# Altium schematic sheet Ublox_breakout_schem.SchDoc
size E
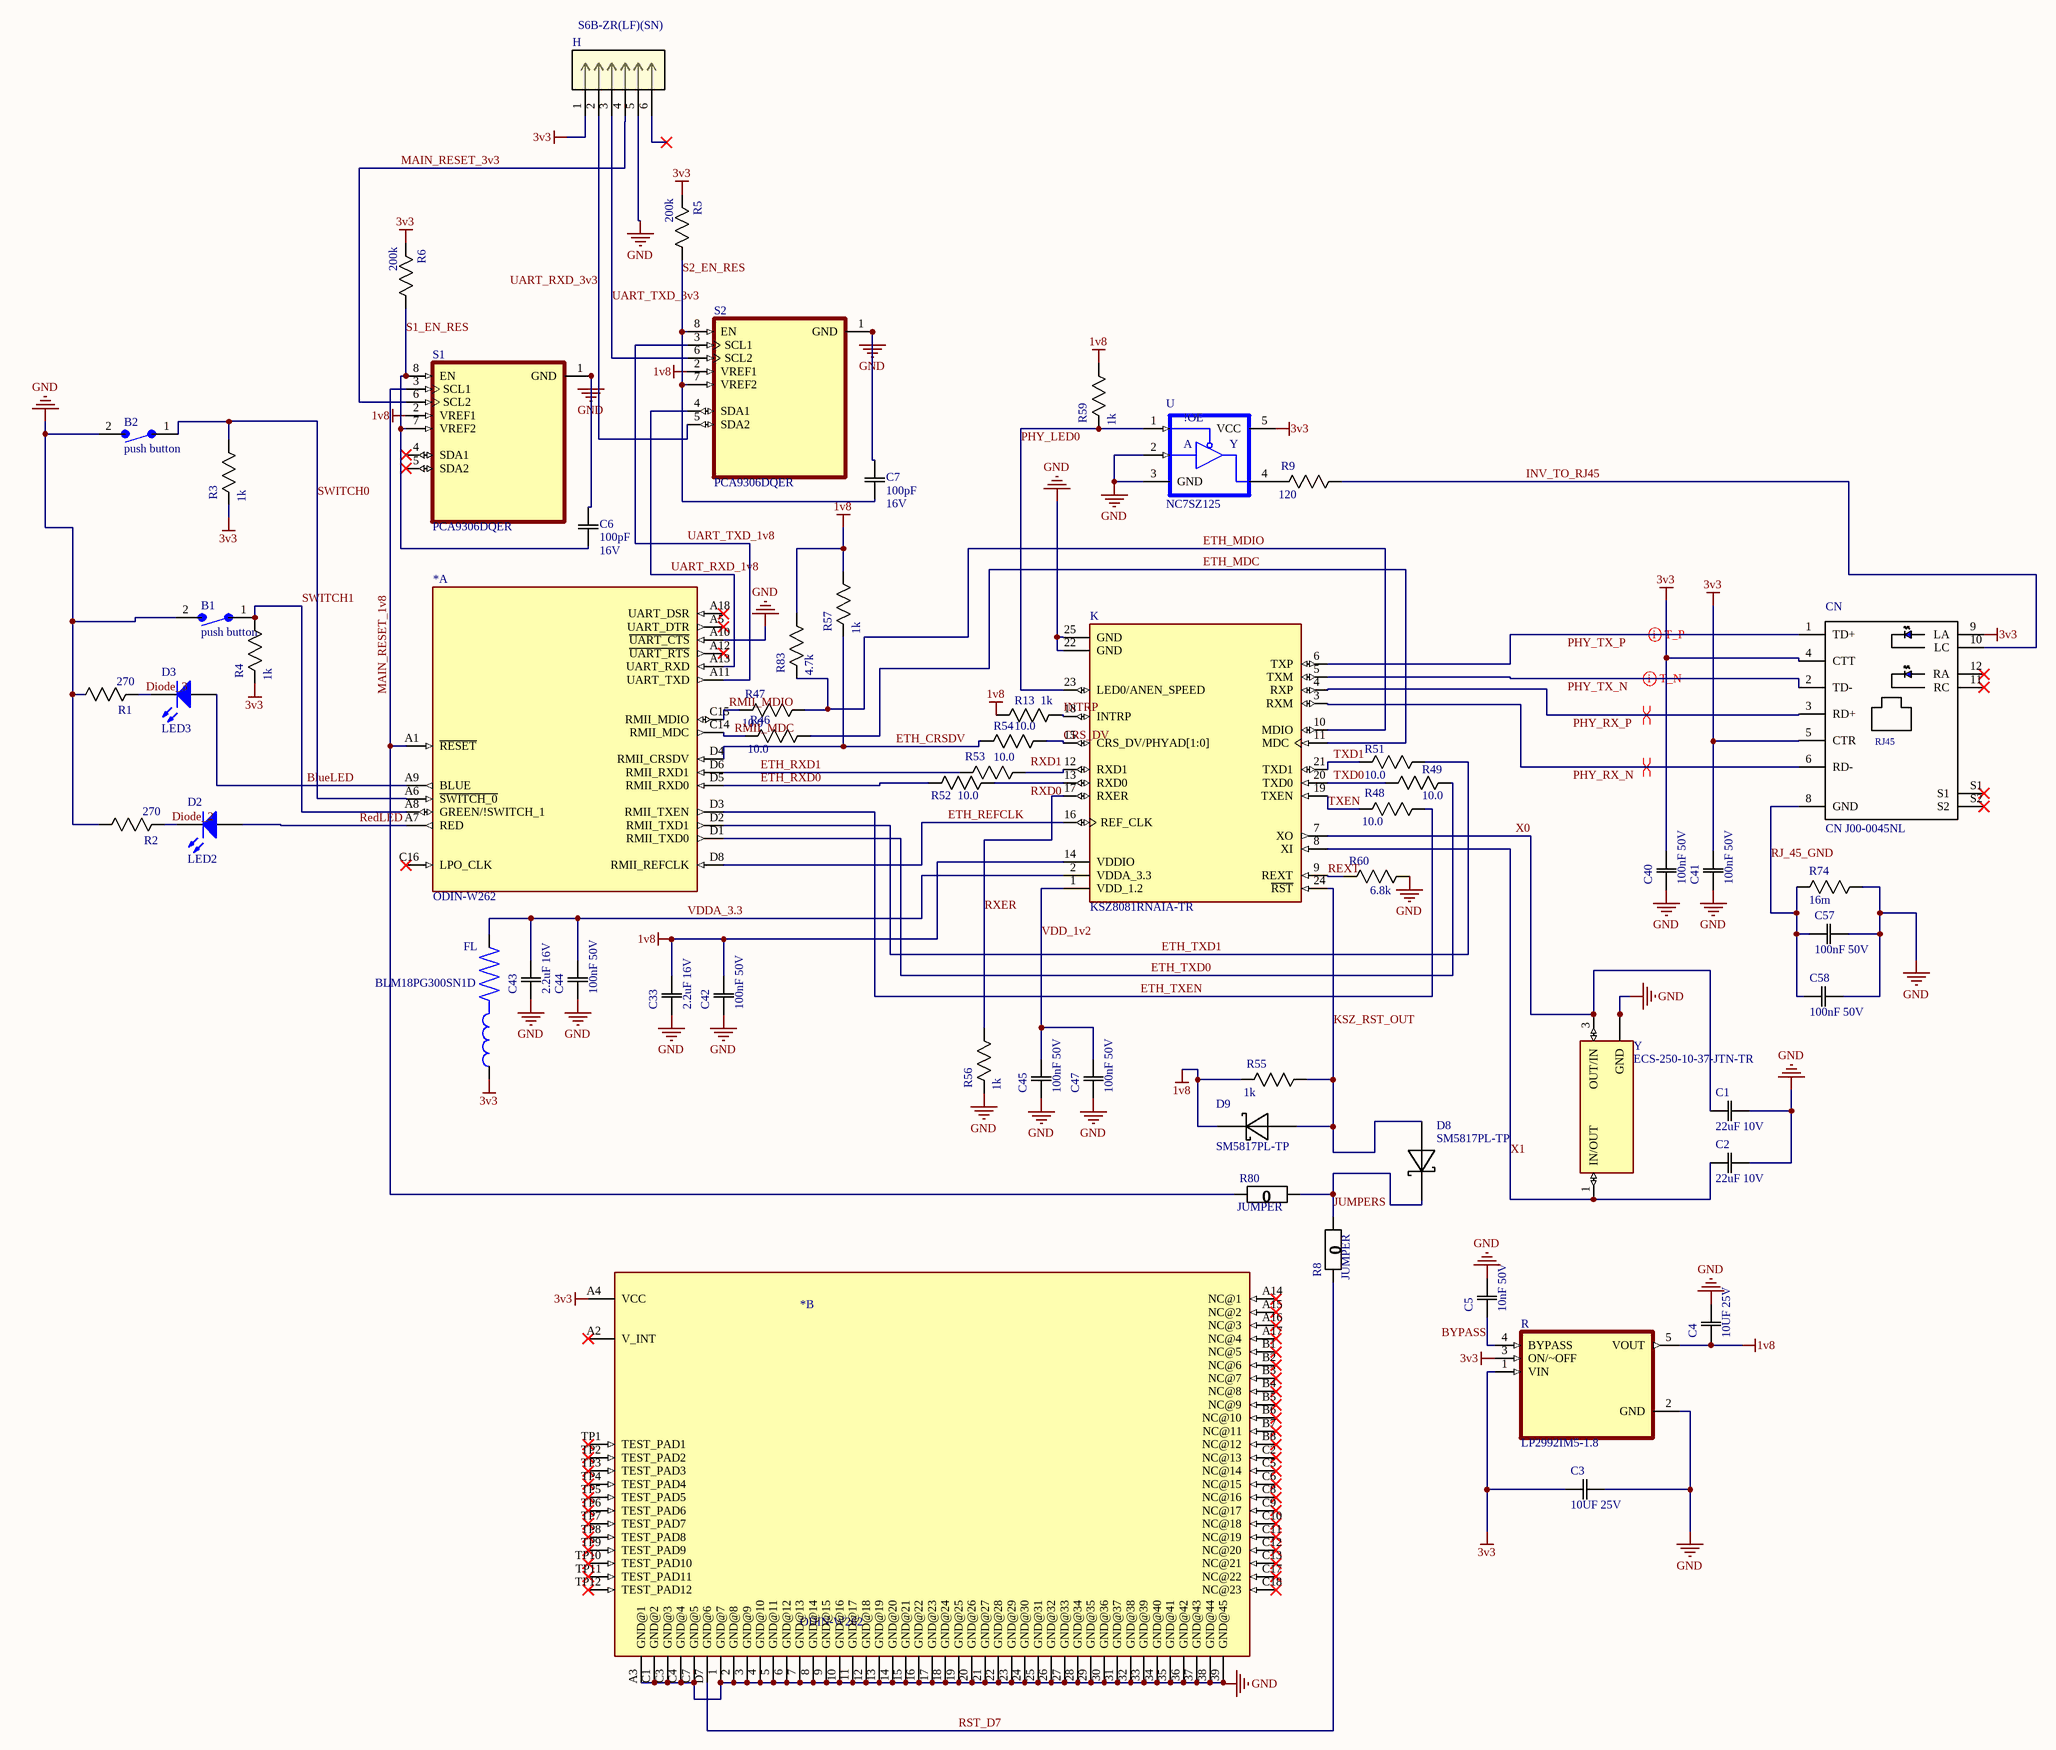
[diagram p0: Ublox_breakout_schem.SchDoc]

## Parts
(Parts that share a designator on the sheet are numbered #1, #2 ... from top to bottom, then left to right.)
*#1  ODIN-W262  [ODIN-W262]  (part A of 2)
*#2  ODIN-W262  [ODIN-W262]  (part B of 2)
B1  push button  [TECO-FSMSM]
B2  push button  [TECO-FSMSM]
C1  22uF 10V  [0805]
C2  22uF 10V  [0805]
C3  10UF 25V  [1206]
C4  10UF 25V  [1206]
C5  10nF 50V  [0805]
C6  Rating: 16V  [0603]  (hidden comment: 100pF)
C7  Rating: 16V  [0603]  (hidden comment: 100pF)
C33  2.2uF 16V  [0805]
C40  100nF 50V  [0805]
C41  100nF 50V  [0805]
C42  100nF 50V  [0805]
C43  2.2uF 16V  [0805]
C44  100nF 50V  [0805]
C45  100nF 50V  [0805]
C47  100nF 50V  [0805]
C57  100nF 50V  [0805]
C58  100nF 50V  [0805]
CN  CN J00-0045NL  [RJ45 J00-0045NL]
D2  LED2  [3.2X1.6X1.1]
D3  LED3  [3.5X2.8X1.9]
D8  SM5817PL-TP  [SOD-123]
D9  SM5817PL-TP  [SOD-123]
FL  BLM18PG300SN1D  [BEADC1608X95N]
H  S6B-ZR(LF)(SN)  [S6B-ZR_JST]
K  KSZ8081RNAIA-TR  [QFN50P400X400X90-25N]
R  LP2992IM5-1.8  [SOT95P280X145-5N]
R1  270  [0805]
R2  270  [0805]
R3  1k  [0805]
R4  1k  [0805]
R5  200k  [0805]
R6  200k  [0805]
R8  JUMPER  [0805]
R9  120  [0805]
R13  1k  [0805]
R46  10.0  [0805]
R47  10.0  [0805]
R48  10.0  [0805]
R49  10.0  [0805]
R51  10.0  [0805]
R52  10.0  [0805]
R53  10.0  [0805]
R54  10.0  [0805]
R55  1k  [0805]
R56  1k  [0805]
R57  1k  [0805]
R59  1k  [0805]
R60  6.8k  [0805]
R74  16m  [0805]
R80  JUMPER  [0805]
R83  4.7k  [0805]
S1  PCA9306DQER  [SON35P140X100X40-8N]
S2  PCA9306DQER  [SON35P140X100X40-8N]
U  NC7SZ125  [SC70-5]
Y  ECS-250-10-37-JTN-TR  [XTAL_ECS-250-10-37-JTN-TR]

## Nets
1v8: C4.1(C1) C33.2(C2) C42.2(C2) D9.C(K) K.14(VDDIO) R.5(VOUT) R13.2(R2) R55.2(R2) R57.1(R1) R59.1(R1) R83.1(R1) S1.2(VREF1) S2.2(VREF1)
3v3: *#2.A4(VCC) C3.1(C1) C40.2(C2) C41.2(C2) CN.4(CTT) CN.5(CTR) CN.9(LA) FL.1 H.1 R.1(VIN) R.3(ON/~OFF) R3.2(R2) R4.2(R2) R5.2(R2) R6.2(R2) U.5(VCC)
GND: *#1.A10(~{UART_CTS}) *#2.1(GND@7) *#2.2(GND@8) *#2.3(GND@9) *#2.4(GND@10) *#2.5(GND@11) *#2.6(GND@12) *#2.7(GND@13) *#2.8(GND@14) *#2.9(GND@15) *#2.10(GND@16) *#2.11(GND@17) *#2.12(GND@18) *#2.13(GND@19) *#2.14(GND@20) *#2.15(GND@21) *#2.16(GND@22) *#2.17(GND@23) *#2.18(GND@24) *#2.19(GND@25) *#2.20(GND@26) *#2.21(GND@27) *#2.22(GND@28) *#2.23(GND@29) *#2.24(GND@30) *#2.25(GND@31) *#2.26(GND@32) *#2.27(GND@33) *#2.28(GND@34) *#2.29(GND@35) *#2.30(GND@36) *#2.31(GND@37) *#2.32(GND@38) *#2.33(GND@39) *#2.34(GND@40) *#2.35(GND@41) *#2.36(GND@42) *#2.37(GND@43) *#2.38(GND@44) *#2.39(GND@45) *#2.A3(GND@1) *#2.C1(GND@2) *#2.C3(GND@3) *#2.C4(GND@4) *#2.C7(GND@5) B1.2 B2.2 C1.2(C2) C2.2(C2) C3.2(C2) C4.2(C2) C5.2(C2) C6.2(C2) C7.2(C2) C33.1(C1) C40.1(C1) C41.1(C1) C42.1(C1) C43.1(C1) C44.1(C1) C45.1(C1) C47.1(C1) C57.2(C2) C58.2(C2) H.5 K.22(GND) K.25(GND) R.2(GND) R1.1(R1) R2.1(R1) R56.2(R2) R60.1(R1) R74.1(R1) S1.1(GND) S2.1(GND) U.2(A) U.3(GND) Y.2(GND) Y.4(GND)
BlueLED: *#1.A9(BLUE) D3.1(A)
BYPASS: C5.1(C1) R.4(BYPASS)
CRS_DV: K.15(CRS_DV/PHYAD[1:0]) R54.1(R1)
Diode_2: D2.2(K) R2.2(R2)
Diode_3: D3.2(K) R1.2(R2)
ETH_CRSDV: *#1.D4(RMII_CRSDV) R54.2(R2) R57.2(R2)
ETH_MDC: K.11(MDC) R46.1(R1)
ETH_MDIO: K.10(MDIO) R47.1(R1) R83.2(R2)
ETH_REFCLK: *#1.D8(RMII_REFCLK) K.16(REF_CLK)
ETH_RXD0: *#1.D5(RMII_RXD0) R52.2(R2)
ETH_RXD1: *#1.D6(RMII_RXD1) R53.2(R2)
ETH_TXD0: *#1.D1(RMII_TXD0) R49.1(R1)
ETH_TXD1: *#1.D2(RMII_TXD1) R51.1(R1)
ETH_TXEN: *#1.D3(RMII_TXEN) R48.1(R1)
INTRP: K.18(INTRP) R13.1(R1)
INV_TO_RJ45: CN.10(LC) R9.1(R1)
JUMPERS: D8.C(K) R8.1(R1) R80.1(R1)
KSZ_RST_OUT: D8.A D9.A K.24(~{RST}) R55.1(R1)
MAIN_RESET_1v8: *#1.A1(~{RESET}) R80.2(R2) S1.3(SCL1)
MAIN_RESET_3v3: H.4 S1.6(SCL2)
PHY_LED0: K.23(LED0/ANEN_SPEED) R59.2(R2) U.1(OE#)
PHY_RX_N: CN.6(RD-) K.3(RXM)
PHY_RX_P: CN.3(RD+) K.4(RXP)
PHY_TX_N: CN.2(TD-) K.5(TXM)
PHY_TX_P: CN.1(TD+) K.6(TXP)
RedLED: *#1.A7(RED) D2.1(A)
REXT: K.9(REXT) R60.2(R2)
RJ_45_GND: C57.1(C1) C58.1(C1) CN.8(GND) R74.2(R2)
RMII_MDC: *#1.C14(RMII_MDC) R46.2(R2)
RMII_MDIO: *#1.C15(RMII_MDIO) R47.2(R2)
RST_D7: *#2.D7(GND@6) R8.2(R2)
RXD0: K.13(RXD0) R52.1(R1)
RXD1: K.12(RXD1) R53.1(R1)
RXER: K.17(RXER) R56.1(R1)
S1_EN_RES: C6.1(C1) R6.1(R1) S1.7(VREF2) S1.8(EN)
S2_EN_RES: C7.1(C1) R5.1(R1) S2.7(VREF2) S2.8(EN)
SWITCH0: *#1.A6(~{SWITCH_0}) B2.1 R3.1(R1)
SWITCH1: *#1.A8(GREEN/!SWITCH_1) B1.1 R4.1(R1)
TXD0: K.20(TXD0) R49.2(R2)
TXD1: K.21(TXD1) R51.2(R2)
TXEN: K.19(TXEN) R48.2(R2)
UART_RXD_1v8: *#1.A13(UART_RXD) S2.4(SDA1)
UART_RXD_3v3: H.2 S2.5(SDA2)
UART_TXD_1v8: *#1.A11(UART_TXD) S2.3(SCL1)
UART_TXD_3v3: H.3 S2.6(SCL2)
VDD_1v2: C45.2(C2) C47.2(C2) K.1(VDD_1.2)
VDDA_3.3: C43.2(C2) C44.2(C2) FL.2 K.2(VDDA_3.3)
X0: C1.1(C1) K.7(XO) Y.3(OUT/IN)
X1: C2.1(C1) K.8(XI) Y.1(IN/OUT)
NetR9_2: R9.2(R2) U.4(Y)

Not connected (* = marked no-connect by the designer): *#1 A5(UART_DTR)* A12(~{UART_RTS})* A18(UART_DSR)* C16(LPO_CLK)*; *#2 A2(V_INT)* A14(NC@1)* A15(NC@2)* A16(NC@3)* A17(NC@4)* B1(NC@5)* B2(NC@6)* B3(NC@7)* B4(NC@8)* B5(NC@9)* B6(NC@10)* B7(NC@11)* B8(NC@12)* C2(NC@13)* C5(NC@14)* C6(NC@15)* C8(NC@16)* C9(NC@17)* C10(NC@18)* C11(NC@19)* C12(NC@20)* C13(NC@21)* C17(NC@22)* C18(NC@23)* TP1(TEST_PAD1)* TP2(TEST_PAD2)* TP3(TEST_PAD3)* TP4(TEST_PAD4)* TP5(TEST_PAD5)* TP6(TEST_PAD6)* TP7(TEST_PAD7)* TP8(TEST_PAD8)* TP9(TEST_PAD9)* TP10(TEST_PAD10)* TP11(TEST_PAD11)* TP12(TEST_PAD12)*; CN 11(RC)* 12(RA)* S1* S2*; H 6*; S1 4(SDA1)* 5(SDA2)*

## Layout directives
differential pair: PHY_RX_N, PHY_RX_P, PHY_TX_N, PHY_TX_P

## Notes on the sheet
- (in symbol CN MAGJACK) RJ45
- (in symbol NC7SZ125) !OE

## Library data of the parts
B1 B2 = Teco-FSMSM
C1 C2 = CAP 22uF 10V: CAP CER 2.2UF 10V X5R 0805; Tolerance: 20%; Package: 0805; Value: 22uF; Rating: 10V; Temperature Coefficient: X5R; Operating Temperature: -55°C ~ 85°C
C3 C4 = CAP 10uF 25V: CAP CER 10UF 25V X5R 1206; Tolerance: 10%; Package: 1206; Value: 10uF; Rating: 25V; Temperature Coefficient: X5R; Operating Temperature: -55°C ~ 85°C
C5 = CAP 10nF 50V: CAP CER 10000PF 50V X7R 0805; Tolerance: 10%; Package: 0805; Value: 10nF; Rating: 50V; Temperature Coefficient: X7R; Operating Temperature: -55°C ~ 125°C
C6 C7 = CAP 100pF 16V: CAP CER 100PF 16V X5R 0603/0805; Tolerance: 10%; Package: 0603/0805; Temperature Coefficient: X5R; Operating Temperature: -55°C ~ 85°C; Value: 100pF
C33 C43 = CAP 2.2uF 16V: CAP CER 2.2UF 16V X7R 0805; Tolerance: 10%; Package: 0805; Value: 2.2uF; Rating: 16V; Temperature Coefficient: X7R; Operating Temperature: -55°C ~ 125°C
C40-C42 C44 C45 C47 C57 C58 = CAP 100nF 50V: CAP CER 0.1UF 50V X7R 0805; Tolerance: 10%; Package: 0805; Value: 100nF; Rating: 50V
CN = CN MAGJACK: CN MAGJACK 1PORT 100 BASE-TX; MF: Pulse Electronics; Package: None; Digikey Link: https://www.digikey.com/product-detail/en/pulse-electronics-network/J00-0045NL/553-1619-5-ND/1036860?utm_source=snapeda&utm_medium=aggregator&utm_campaign=symbol; Digikey: 553-1619-5-ND; SnapEDA_Link: https://www.snapeda.com/parts/J00-0045NL/Pulse%20Electronics%20Network/view-part/87956/?ref=snap; MP: J00-0045NL; Value: *; Supplier 1: Mouser; Supplier Part Number 1: 673-J00-0045NL
D2 = LED RED SMD: Typical RED, GREEN, YELLOW, AMBER GaAs LED; Lens Color: Colorless; Voltage - Forward (Vf) (Typ): 1.7V; Current - Test: 20mA; Lens Transparency: Clear; Color: Red; Package: 1206
D3 = LED3: Typical BLUE SiC LED; Published: 8-Jun-2000; LatestRevisionDate: 17-Dec-2003; LatestRevisionNote: PCB Footprint replaced.; DatasheetVersion: 16-Apr-2002; PackageVersion: 16-Apr-2002; PackageReference: 3.5X2.8X1.9; Publisher: Altium Limited; PackageDescription: SM LED; 2 C-Bend Leads; Body 3.5 x 2.8 x 1.9 mm, inc leads (LxWxH typ)
D8 D9 = DIODE SCHOTTKY 20V 1A: Diode Schottky 20V 1A Surface Mount SOD-123FL; MF: Micro Commercial Co; ComponentLink1Description: digikey; ComponentLink1URL: https://www.digikey.ca/product-detail/en/on-semiconductor/MBR0540T1G/MBR0540T1GOSCT-ND/917967; Digikey: SM5817PL-TPMSCT-ND; Digikey Link: https://www.digikey.ca/product-detail/en/micro-commercial-co/SM5817PL-TP/SM5817PL-TPMSCT-ND/1793410; MP: SM5817PL-TP; Voltage Rating: 20V; Package: SOD-123; Current Rating: 1A
FL = BLM18PG300SN1D: 30 Ohms @ 100MHz 1 Power Line Ferrite Bead 0603 _1608 Metric_ 1A 50mOhm; MF: Murata; SnapEDA_Link: https://www.snapeda.com/parts/BLM18PG300SN1D/Murata/view-part/270173/?ref=snap; Price: None; Availability: Unavailable; Package: 1608 Murata; MP: BLM18PG300SN1D; Value: *
H = S6B-ZR(LF)(SN): No Description Available; Vendor: JST; Built_By: EMA_UL_Team; SourceLibrary: JST_2017-04-18; Manufacturer_Part_Number: S6B-ZR(LF)(SN); Copyright: Copyright (C) 2018 Accelerated Designs. All rights reserved; RefDes: RefDes; Type: DEV
K = KSZ8081RNAIA-TR: 1/1 Transceiver Full RMII 24-QFN _4x4_; MF: Microchip; Price: None; MP: KSZ8081RNAIA-TR; Value: *; Availability: Unavailable; SnapEDA_Link: https://www.snapeda.com/parts/KSZ8081RNAIA-TR/Microchip/view-part/482545/?ref=snap; Package: QFN-24 Microchip
R = LP2992IM5-1.8: MP: LP2992IM5-1.8/NOPB; Package: None; Price: None; Value: *; Availability: Unavailable
R1 R2 = RES 270 1/8W: RES SMD 270 OHM 5% 1/8W 0805; Power (Watts): 0.125W; Package: 0805; Value: 270; Tolerance: 5%
R3 R4 R13 R55-R57 R59 = RES 1k 1/8W: RES SMD 1K OHM 5% 1/8W 0805; Power (Watts): 0.125W; Package: 0805; Value: 1k; Tolerance: 5%
R5 R6 = RES 200k 1/8W: RES SMD 200K OHM 5% 1/8W 0805; Power (Watts): 0.125W; Package: 0805; Value: 200k; Tolerance: 5%
R8 R80 = RES 0 JUMPER: RES SMD 0 OHM JUMPER GENERIC 0805; Value: 0; Package: 0805
R9 = RES 120.0 1/8W: RES SMD 120 OHM 5% 1/8W 0805; Power (Watts): 0.125W; Package: 0805; Value: 120; Tolerance: 5%
R46-R49 R51-R54 = RES 10.0 1/8W - 5%: RES SMD 10.0 OHM 5% 1/8W 0805; Power (Watts): 0.125W; Package: 0805; Value: 10.0; Tolerance: 5%
R60 = RES 6.8k 1/8W: RES SMD 6.8K OHM 5% 1/8W 0805; Power (Watts): 0.125W; Package: 0805; Value: 6.8k; Tolerance: 5%
R74 = RES 16m 1/2W: RES SMD 0.016 OHM 1% 1/2W 0805 Thick Film; Manufacturer: Panasonic; Manufacturer Part Number: ERJ-6BWFR016V; Resistance: 16mR; Power Rating: 500mW; Temperature Coefficient: 200ppm/°C; Supplier 1: Digi-Key; RoHS: Yes; Category: Chip SMD Resistors; Stock 1: 4585; Pricing 1: 1=0.65000, 10=0.53800, 100=0.36140, 1000=0.21148, 2500=0.20917 (USD); Mount: Surface Mount; Case/Package: 0805; Number of Pins: 2; Contact Plating: Tin; Case Code (Metric): 2012; Case Code (Imperial): 0805; Min Operating Temperature: -55°C; Max Operating Temperature: 155°C; Tolerance: 1%; Packaging: Tape and Reel; Package Quantity: 1; Features: Automotive AEC-Q200; Max Power Dissipation: 500mW; Composition: Thick Film; Number of Terminations: 2; Termination: SMD/SMT; Military Standard: Not; Length: 2mm; Height: 0.028inch; Width: 0.049inch; Depth: 1.25mm; Radiation Hardening: No; Lead Free: Lead Free; ComponentLink1URL: https://datasheet.ciiva.com/11808/0900766b8126441d-11808690.pdf?src-supplier=RSComponents; ComponentLink1Description: https://datasheet.ciiva.com/11808/0900766b8126441d-11808690.pdf?src-supplier=RSComponents; ComponentLink2URL: https://datasheet.ciiva.com/2452/aoa0000ce3-2452594.pdf?src-supplier=Digi-Key; ComponentLink2Description: https://datasheet.ciiva.com/2452/aoa0000ce3-2452594.pdf?src-supplier=Digi-Key; ComponentLink3URL: https://datasheet.ciiva.com/2452/aoa0000ce3-2452592.pdf?src-supplier=Digi-Key; ComponentLink3Description: https://datasheet.ciiva.com/2452/aoa0000ce3-2452592.pdf?src-supplier=Digi-Key; ComponentLink4URL: https://datasheet.ciiva.com/2452/aoa0000ce3-2452593.pdf?src-supplier=Digi-Key; ComponentLink4Description: https://datasheet.ciiva.com/2452/aoa0000ce3-2452593.pdf?src-supplier=Digi-Key; ComponentLink5URL: https://datasheet.ciiva.com/9192/aoa0000ce3-9192761.pdf?src-supplier=Avnet; ComponentLink5Description: https://datasheet.ciiva.com/9192/aoa0000ce3-9192761.pdf?src-supplier=Avnet; ComponentLink6URL: https://datasheet.ciiva.com/17211/aoa0000ce3-17211370.pdf?src-supplier=Avnet+Europe; ComponentLink6Description: https://datasheet.ciiva.com/17211/aoa0000ce3-17211370.pdf?src-supplier=Avnet+Europe; Supplier Part Number 1: P.016AQCT-ND
R83 = RES 4.7k 1/8W - 5%: RES SMD 4.7k OHM 5% 1/8W 0805; Power (Watts): 0.125W; Package: 0805; Value: 4.7k; Tolerance: 5%
S1 S2 = PCA9306DQER: 2-bit bidirectional I2C bus and SMBus voltage-level shifter 8-X2SON -40 to 85; MF: Texas Instruments; Value: *; Price: None; Mouser-Purchase-URL: https://snapeda.com/shop?store=Mouser&id=39064; Package: X2SON-8 Texas Instruments; Texas_Instruments-Purchase-URL: https://snapeda.com/shop?store=Texas+Instruments&id=39064; SnapEDA_Link: https://www.snapeda.com/parts/PCA9306DQER/Texas%20Instruments/view-part/39064/?ref=snap; Availability: Warning; MP: PCA9306DQER
U = NC7SZ125: Buffer, Non-Inverting 1 Element 1 Bit per Element 3-State Output SC-70-5; MF: ON Semiconductor; SnapEDA_Link: https://www.snapeda.com/parts/NC7SZ125/ON%20Semiconductor/view-part/2686816/?ref=snap; Availability: Unavailable; Price: None; Package: SC-70 ON Semiconductor; MP: NC7SZ125; Value: *
Y = ECS-250-10-37-JTN-TR: SMD Crystal 2.0 x 1.6 x 0.45 mm ceramic package; Package: None; Price: None; Value: *; MP: ECS-250-10-37-JTN-TR; Availability: Unavailable